# Altium schematic sheet TLD.SchDoc
size 259 x 167 mm; SheetNumber: 1; SheetTotal: 15
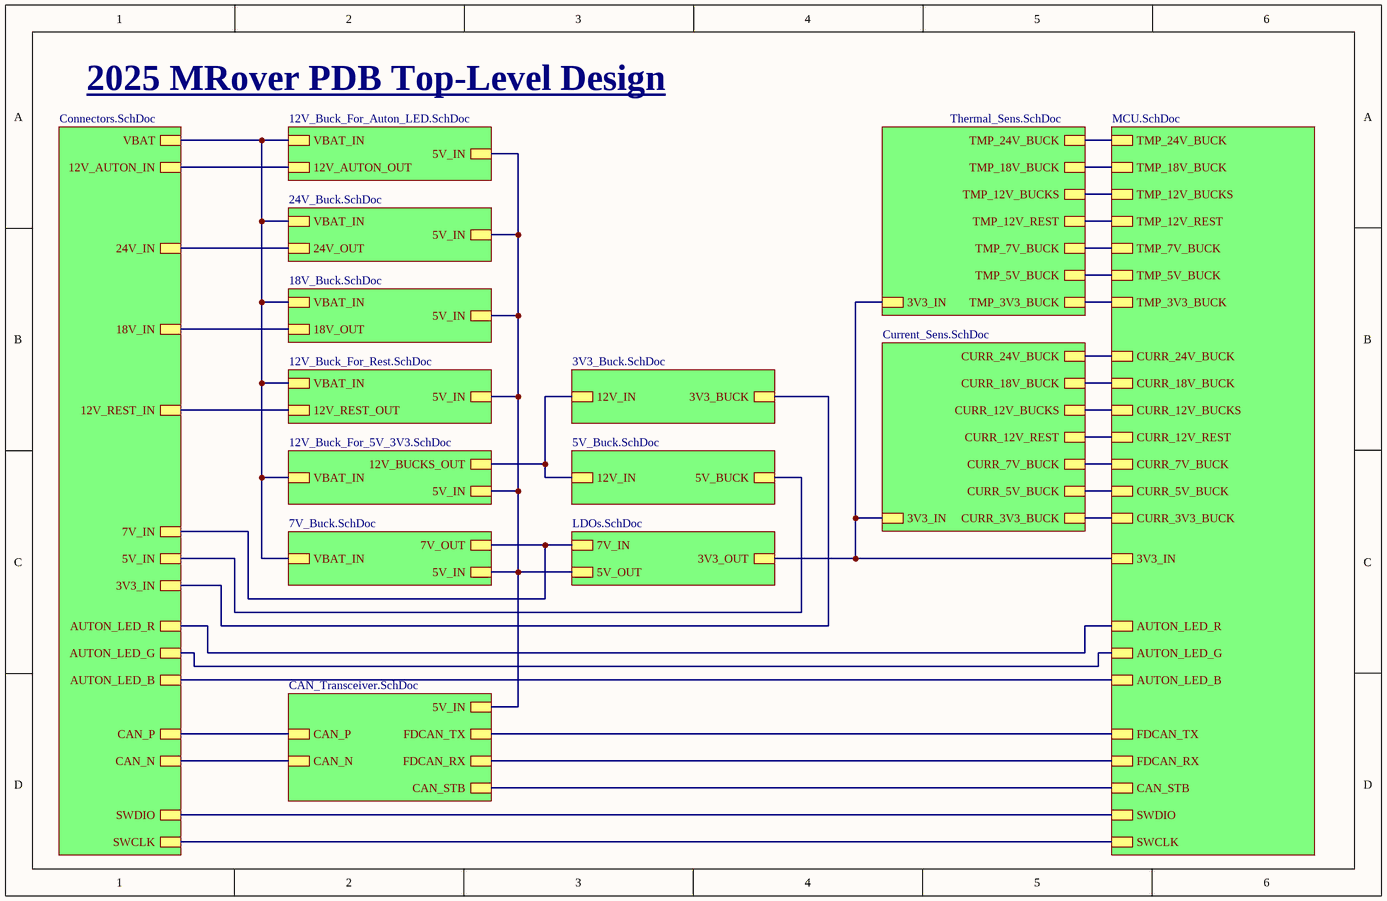
[diagram p0: TLD.SchDoc]

## Sub-sheets
Designator = 7V_Buck.SchDoc: 7V_OUT, 5V_IN, VBAT_IN
Designator = 12V_Buck_For_5V_3V3.SchDoc: 12V_BUCKS_OUT, 5V_IN, VBAT_IN
Designator = 12V_Buck_For_Rest.SchDoc: 12V_REST_OUT, 5V_IN, VBAT_IN
Designator = CAN_Transceiver.SchDoc: 5V_IN, FDCAN_TX, FDCAN_RX, CAN_STB, CAN_P, CAN_N
Designator = Connectors.SchDoc: VBAT, 24V_IN, 18V_IN, 12V_AUTON_IN, CAN_P, CAN_N, 12V_REST_IN, 7V_IN, SWDIO, SWCLK, 5V_IN, 3V3_IN, AUTON_LED_R, AUTON_LED_G, AUTON_LED_B
Designator = Current_Sens.SchDoc: CURR_24V_BUCK, CURR_12V_BUCKS, CURR_18V_BUCK, CURR_12V_REST, CURR_7V_BUCK, CURR_5V_BUCK, CURR_3V3_BUCK, 3V3_IN
Designator = LDOs.SchDoc: 3V3_OUT, 5V_OUT, 7V_IN
Designator = MCU.SchDoc: CURR_24V_BUCK, CURR_18V_BUCK, CURR_12V_BUCKS, CURR_12V_REST, CURR_7V_BUCK, CURR_5V_BUCK, CURR_3V3_BUCK, TMP_24V_BUCK, TMP_18V_BUCK, TMP_12V_BUCKS, TMP_12V_REST, TMP_7V_BUCK, TMP_5V_BUCK, TMP_3V3_BUCK, AUTON_LED_R, AUTON_LED_G, AUTON_LED_B, FDCAN_TX, FDCAN_RX, CAN_STB, 3V3_IN, SWDIO, SWCLK
Designator = Thermal_Sens.SchDoc: TMP_24V_BUCK, TMP_18V_BUCK, TMP_12V_BUCKS, TMP_12V_REST, TMP_7V_BUCK, TMP_5V_BUCK, TMP_3V3_BUCK, 3V3_IN
Designator = 12V_Buck_For_Auton_LED.SchDoc: 12V_AUTON_OUT, 5V_IN, VBAT_IN
Designator = 18V_Buck.SchDoc: 18V_OUT, 5V_IN, VBAT_IN
Designator = 24V_Buck.SchDoc: 24V_OUT, 5V_IN, VBAT_IN
Designator = 3V3_Buck.SchDoc: 3V3_BUCK, 12V_IN
Designator = 5V_Buck.SchDoc: 5V_BUCK, 12V_IN

## Nets
(unnamed): sheet Designator/7V_OUT, sheet Designator/7V_IN, sheet Designator/7V_IN
(unnamed): sheet Designator/5V_IN, sheet Designator/5V_IN, sheet Designator/5V_IN, sheet Designator/5V_IN, sheet Designator/5V_OUT, sheet Designator/5V_IN, sheet Designator/5V_IN, sheet Designator/5V_IN
(unnamed): sheet Designator/VBAT_IN, sheet Designator/VBAT_IN, sheet Designator/VBAT_IN, sheet Designator/VBAT, sheet Designator/VBAT_IN, sheet Designator/VBAT_IN, sheet Designator/VBAT_IN
(unnamed): sheet Designator/12V_BUCKS_OUT, sheet Designator/12V_IN, sheet Designator/12V_IN
(unnamed): sheet Designator/12V_REST_OUT, sheet Designator/12V_REST_IN
(unnamed): sheet Designator/FDCAN_TX, sheet Designator/FDCAN_TX
(unnamed): sheet Designator/FDCAN_RX, sheet Designator/FDCAN_RX
(unnamed): sheet Designator/CAN_STB, sheet Designator/CAN_STB
(unnamed): sheet Designator/CAN_P, sheet Designator/CAN_P
(unnamed): sheet Designator/CAN_N, sheet Designator/CAN_N
(unnamed): sheet Designator/24V_IN, sheet Designator/24V_OUT
(unnamed): sheet Designator/18V_IN, sheet Designator/18V_OUT
(unnamed): sheet Designator/12V_AUTON_IN, sheet Designator/12V_AUTON_OUT
(unnamed): sheet Designator/SWDIO, sheet Designator/SWDIO
(unnamed): sheet Designator/SWCLK, sheet Designator/SWCLK
(unnamed): sheet Designator/5V_IN, sheet Designator/5V_BUCK
(unnamed): sheet Designator/3V3_IN, sheet Designator/3V3_BUCK
(unnamed): sheet Designator/AUTON_LED_R, sheet Designator/AUTON_LED_R
(unnamed): sheet Designator/AUTON_LED_G, sheet Designator/AUTON_LED_G
(unnamed): sheet Designator/AUTON_LED_B, sheet Designator/AUTON_LED_B
(unnamed): sheet Designator/CURR_24V_BUCK, sheet Designator/CURR_24V_BUCK
(unnamed): sheet Designator/CURR_12V_BUCKS, sheet Designator/CURR_12V_BUCKS
(unnamed): sheet Designator/CURR_18V_BUCK, sheet Designator/CURR_18V_BUCK
(unnamed): sheet Designator/CURR_12V_REST, sheet Designator/CURR_12V_REST
(unnamed): sheet Designator/CURR_7V_BUCK, sheet Designator/CURR_7V_BUCK
(unnamed): sheet Designator/CURR_5V_BUCK, sheet Designator/CURR_5V_BUCK
(unnamed): sheet Designator/CURR_3V3_BUCK, sheet Designator/CURR_3V3_BUCK
(unnamed): sheet Designator/3V3_IN, sheet Designator/3V3_OUT, sheet Designator/3V3_IN, sheet Designator/3V3_IN
(unnamed): sheet Designator/TMP_24V_BUCK, sheet Designator/TMP_24V_BUCK
(unnamed): sheet Designator/TMP_18V_BUCK, sheet Designator/TMP_18V_BUCK
(unnamed): sheet Designator/TMP_12V_BUCKS, sheet Designator/TMP_12V_BUCKS
(unnamed): sheet Designator/TMP_12V_REST, sheet Designator/TMP_12V_REST
(unnamed): sheet Designator/TMP_7V_BUCK, sheet Designator/TMP_7V_BUCK
(unnamed): sheet Designator/TMP_5V_BUCK, sheet Designator/TMP_5V_BUCK
(unnamed): sheet Designator/TMP_3V3_BUCK, sheet Designator/TMP_3V3_BUCK

## Notes on the sheet
- 2025 MRover PDB Top-Level Design